# EasyEDA schematic SCH_schematic-alarm_2025-03-28.json
TITLE: Sheet_1; REV: 1.0; Date: 2025-03-26; Sheet: 1/1; Company: Your Company
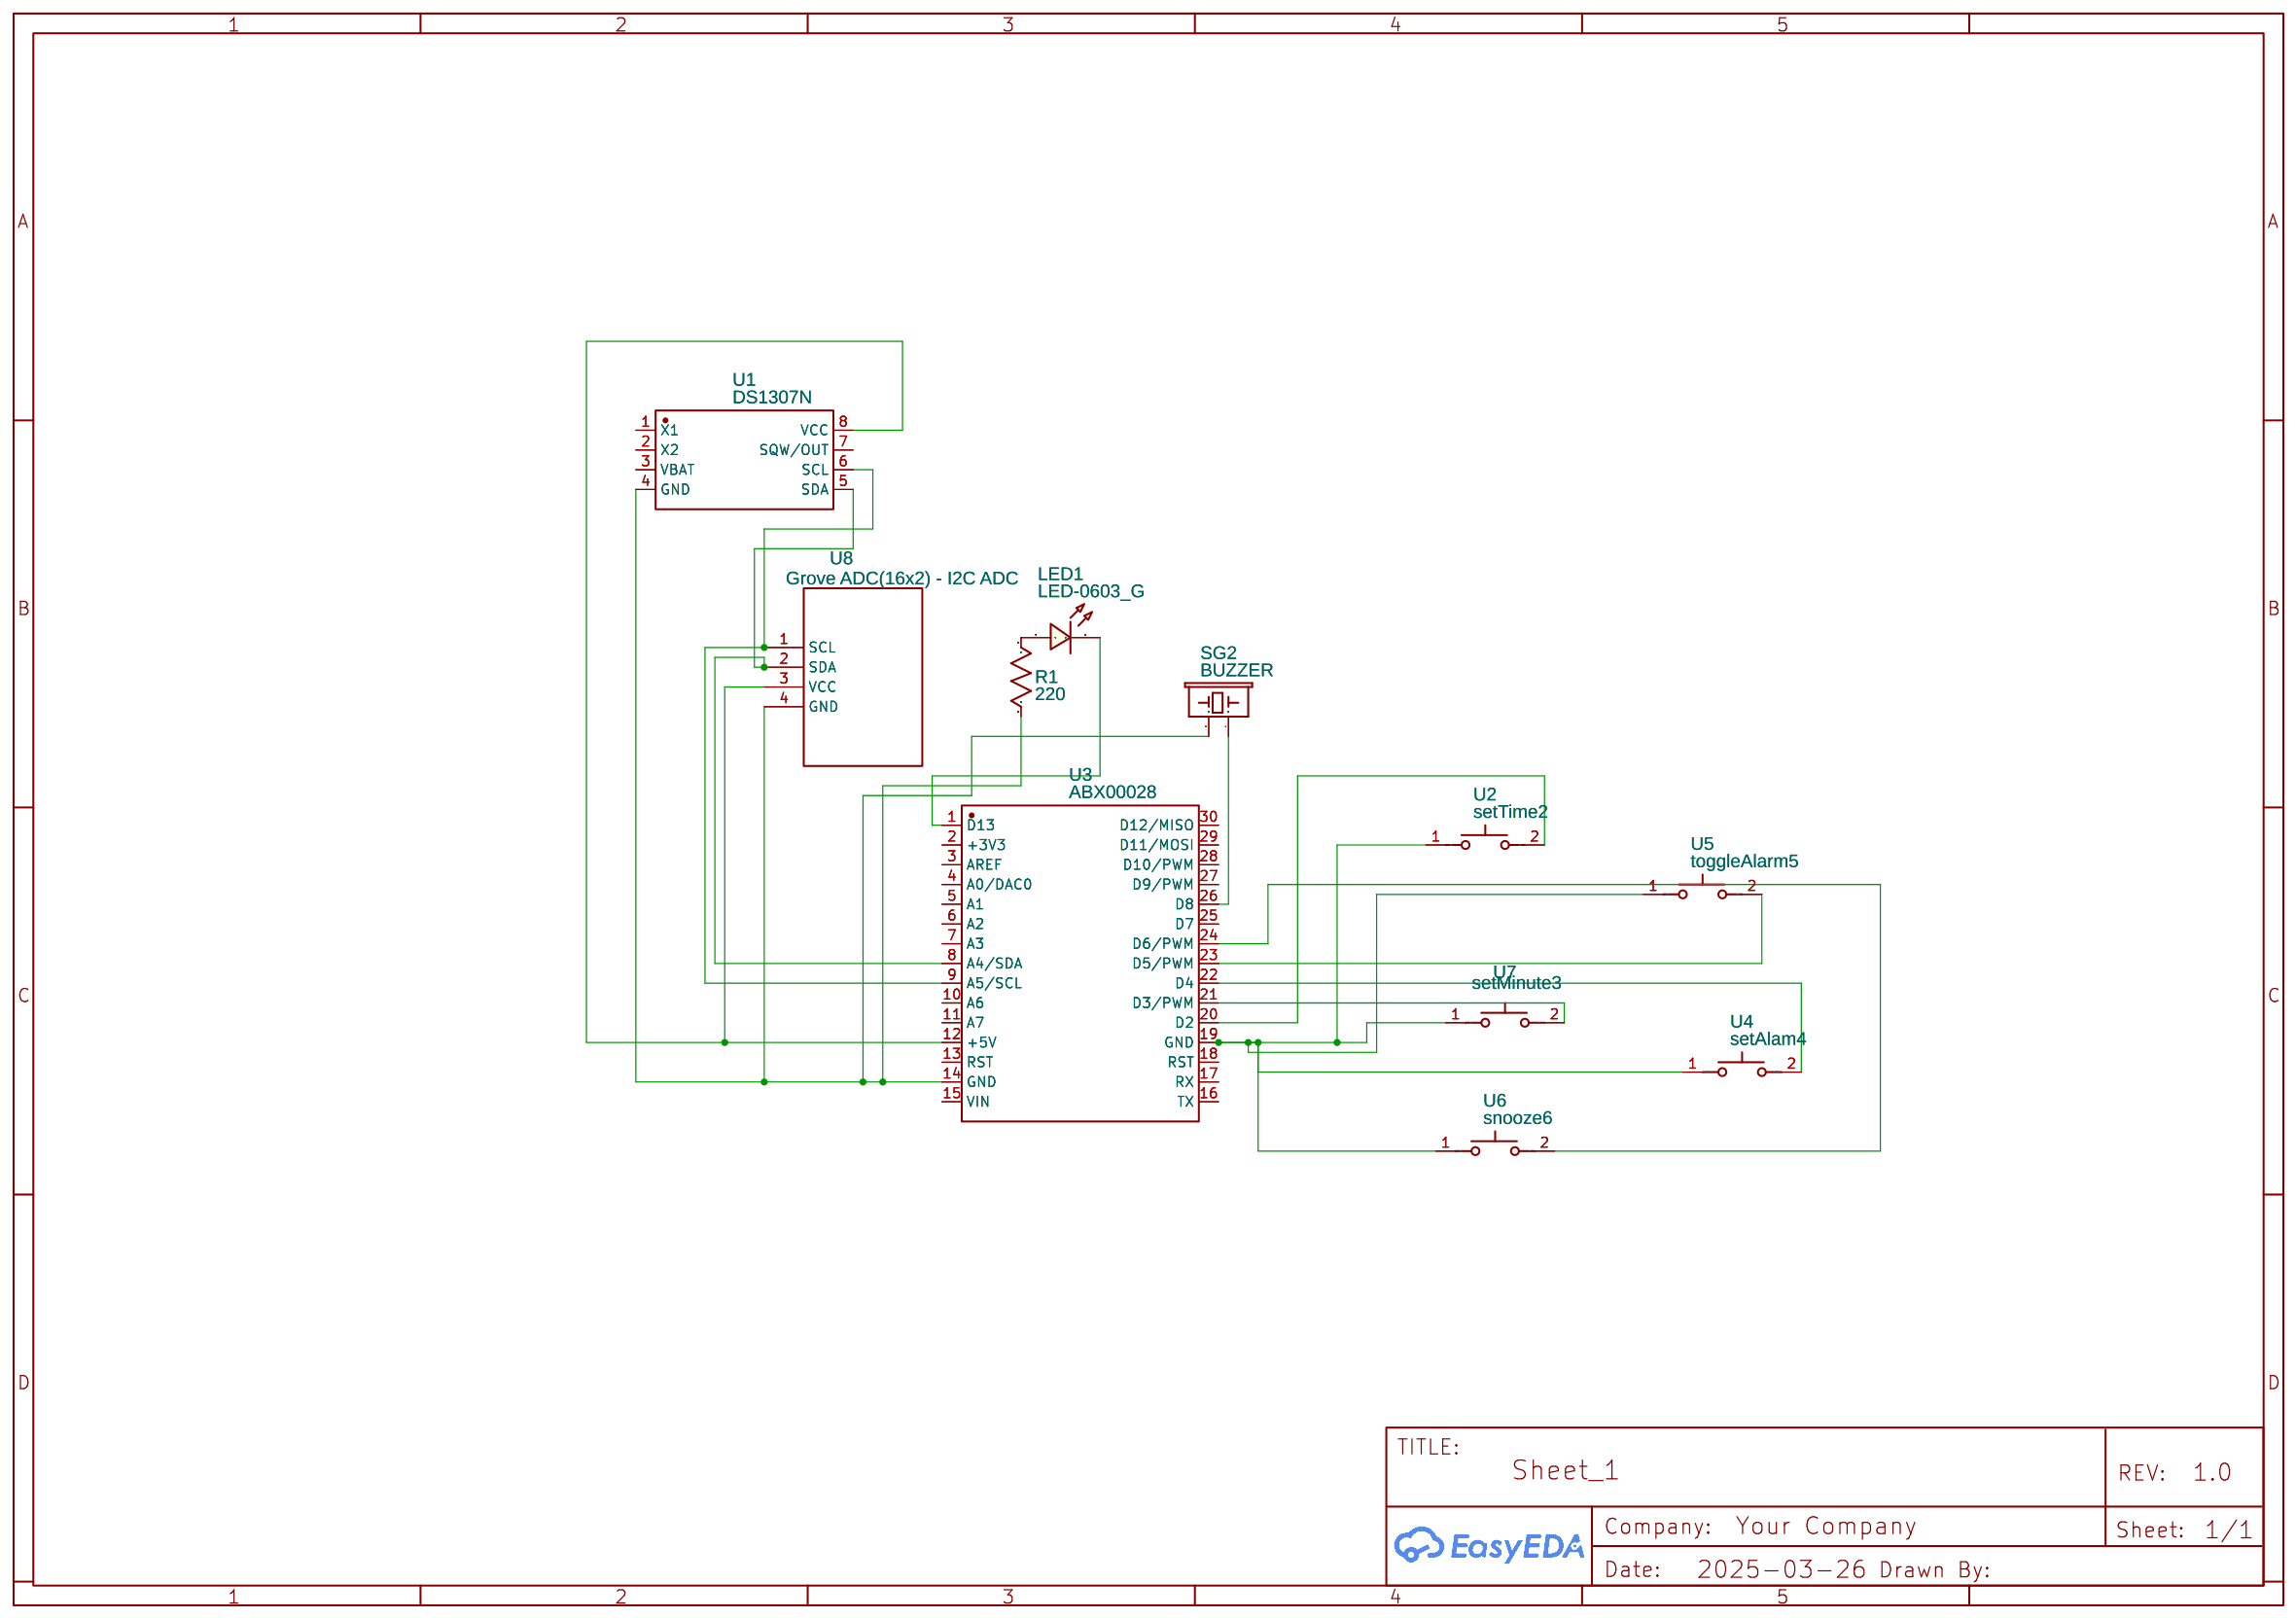
[diagram p0: schematic sheet]

## Parts
LED1  LED-0603_G  [LED0603_GREEN]
R1  220  [R0603]
SG2  BUZZER  [BUZZER-CCV]
U1  DS1307N  [DIP-8_L9.8-W6.6-P2.54-LS7.6-BL]
U2  setTime2  [SW-SMD_L6.0-W3.5-LS8.0-1]
U3  ABX00028  [MOD-TH_ABX00028]
U4  setAlam4  [SW-SMD_L6.0-W3.5-LS8.0-1]
U5  toggleAlarm5  [SW-SMD_L6.0-W3.5-LS8.0-1]
U6  snooze6  [SW-SMD_L6.0-W3.5-LS8.0-1]
U7  setMinute3  [SW-SMD_L6.0-W3.5-LS8.0-1]
U8  Grove ADC(16x2) - I2C ADC  [GROVE - I2C ADC]

## Library data of the parts
LED1 = LED-0603_G: Manufacturer: EVERLIGHT(台湾亿光); Manufacturer Part: 19-217/GHC-YR1S2/3T; Supplier Part: C72043; Supplier: LCSC; Contributor: LCEDA_Lib
R1 = R_0603_US: Contributor: LCEDA_Lib
SG2 = BUZZER: Contributor: SparkFun
U1 = DS1307N: Contributor: LCSC; Supplier: LCSC; Supplier Part: C434596; Manufacturer: HGSEMI(华冠); JLCPCB Part Class: Extended Part
U2 U4-U7 = BUTTON2: Contributor: LCSC; Supplier: LCSC; Supplier Part: C9900005988; Manufacturer: null; JLCPCB Part Class: Extended Part
U3 = ABX00028: Supplier: LCSC; Supplier Part: C21303176; Manufacturer: arduino; Contributor: lcsc
U8 = Grove - I2C ADC: sourceId: V7D93XRKq; Supplier Part: undefined; Supplier: SeeedStudio

## Nets
Net-(LED1-1): LED1.1 R1.1
Net-(LED1-2): LED1.2 U3.1(D13)
Net-(R1-2): R1.2 SG2.+(1) U1.4(GND) U3.14(GND) U8.4(GND)
Net-(SG2--): SG2.-(2) U3.26(D8)
Net-(U1-5): U1.5(SDA) U3.8(A4/SDA) U8.2(SDA)
Net-(U1-6): U1.6(SCL) U3.9(A5/SCL) U8.1(SCL)
Net-(U1-8): U1.8(VCC) U3.12(+5V) U8.3(VCC)
Net-(U2-1): U2.1 U3.19(GND) U4.1 U5.1 U6.1 U7.1
Net-(U2-2): U2.2 U3.20(D2)
Net-(U3-21): U3.21(D3/PWM) U7.2
Net-(U3-22): U3.22(D4) U4.2
Net-(U3-23): U3.23(D5/PWM) U5.2
Net-(U3-24): U3.24(D6/PWM) U6.2

Not connected (* = marked no-connect by the designer): U1 1(X1) 2(X2) 3(VBAT) 7(SQW/OUT); U3 2(+3V3) 3(AREF) 4(A0/DAC0) 5(A1) 6(A2) 7(A3) 10(A6) 11(A7) 13(RST) 15(VIN) 16(TX) 17(RX) 18(RST) 25(D7) 27(D9/PWM) 28(D10/PWM) 29(D11/MOSI) 30(D12/MISO)
